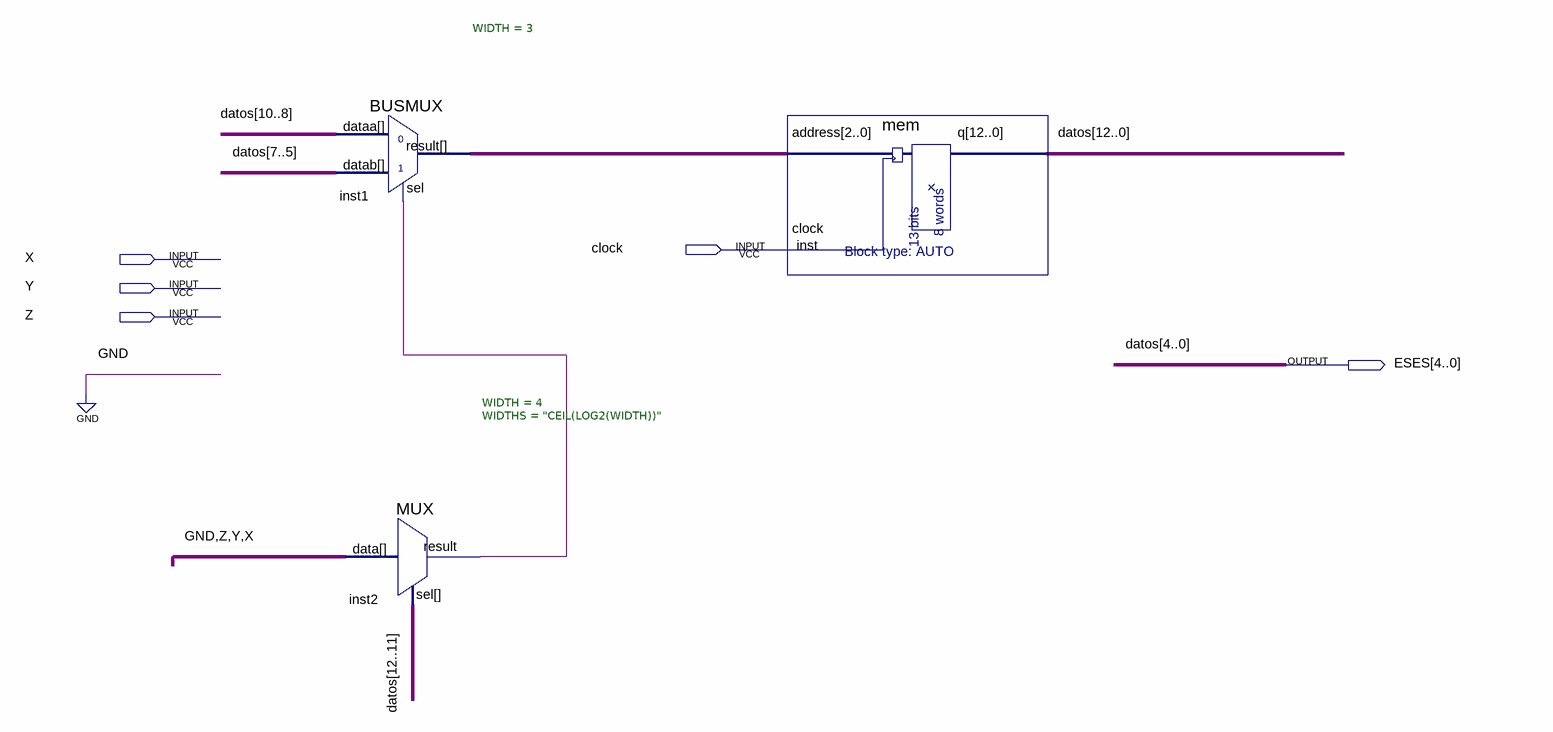
[diagram p0: schematic sheet]
// Quartus schematic ee.bdf as structural Verilog: 3 symbols, 5 pins
module ee (
  input  clock,
  input  X,
  input  Y,
  input  Z,
  output [4:0] ESES
);

  wire inst2_result;
  wire [2:0] inst1_result;
  wire [12:5] datos;

  BUSMUX #(.WIDTH(3)) inst1 (.datab(datos[7:5]), .sel(inst2_result), .dataa(datos[10:8]), .result(inst1_result));
  MUX #(.WIDTH(4), .WIDTHS("CEIL(LOG2(WIDTH))")) inst2 (
    .data({1'b0, Z, Y, X}), .sel(datos[12:11]), .result(inst2_result));
  mem inst (.address(inst1_result), .clock(clock), .q({datos, ESES}));

  // Other names for the same wires on the sheet: datos[4:0] = ESES
endmodule
